# Altium project LPCB235__RLOOP__FCU.PrjPCB (part 7 of 7)
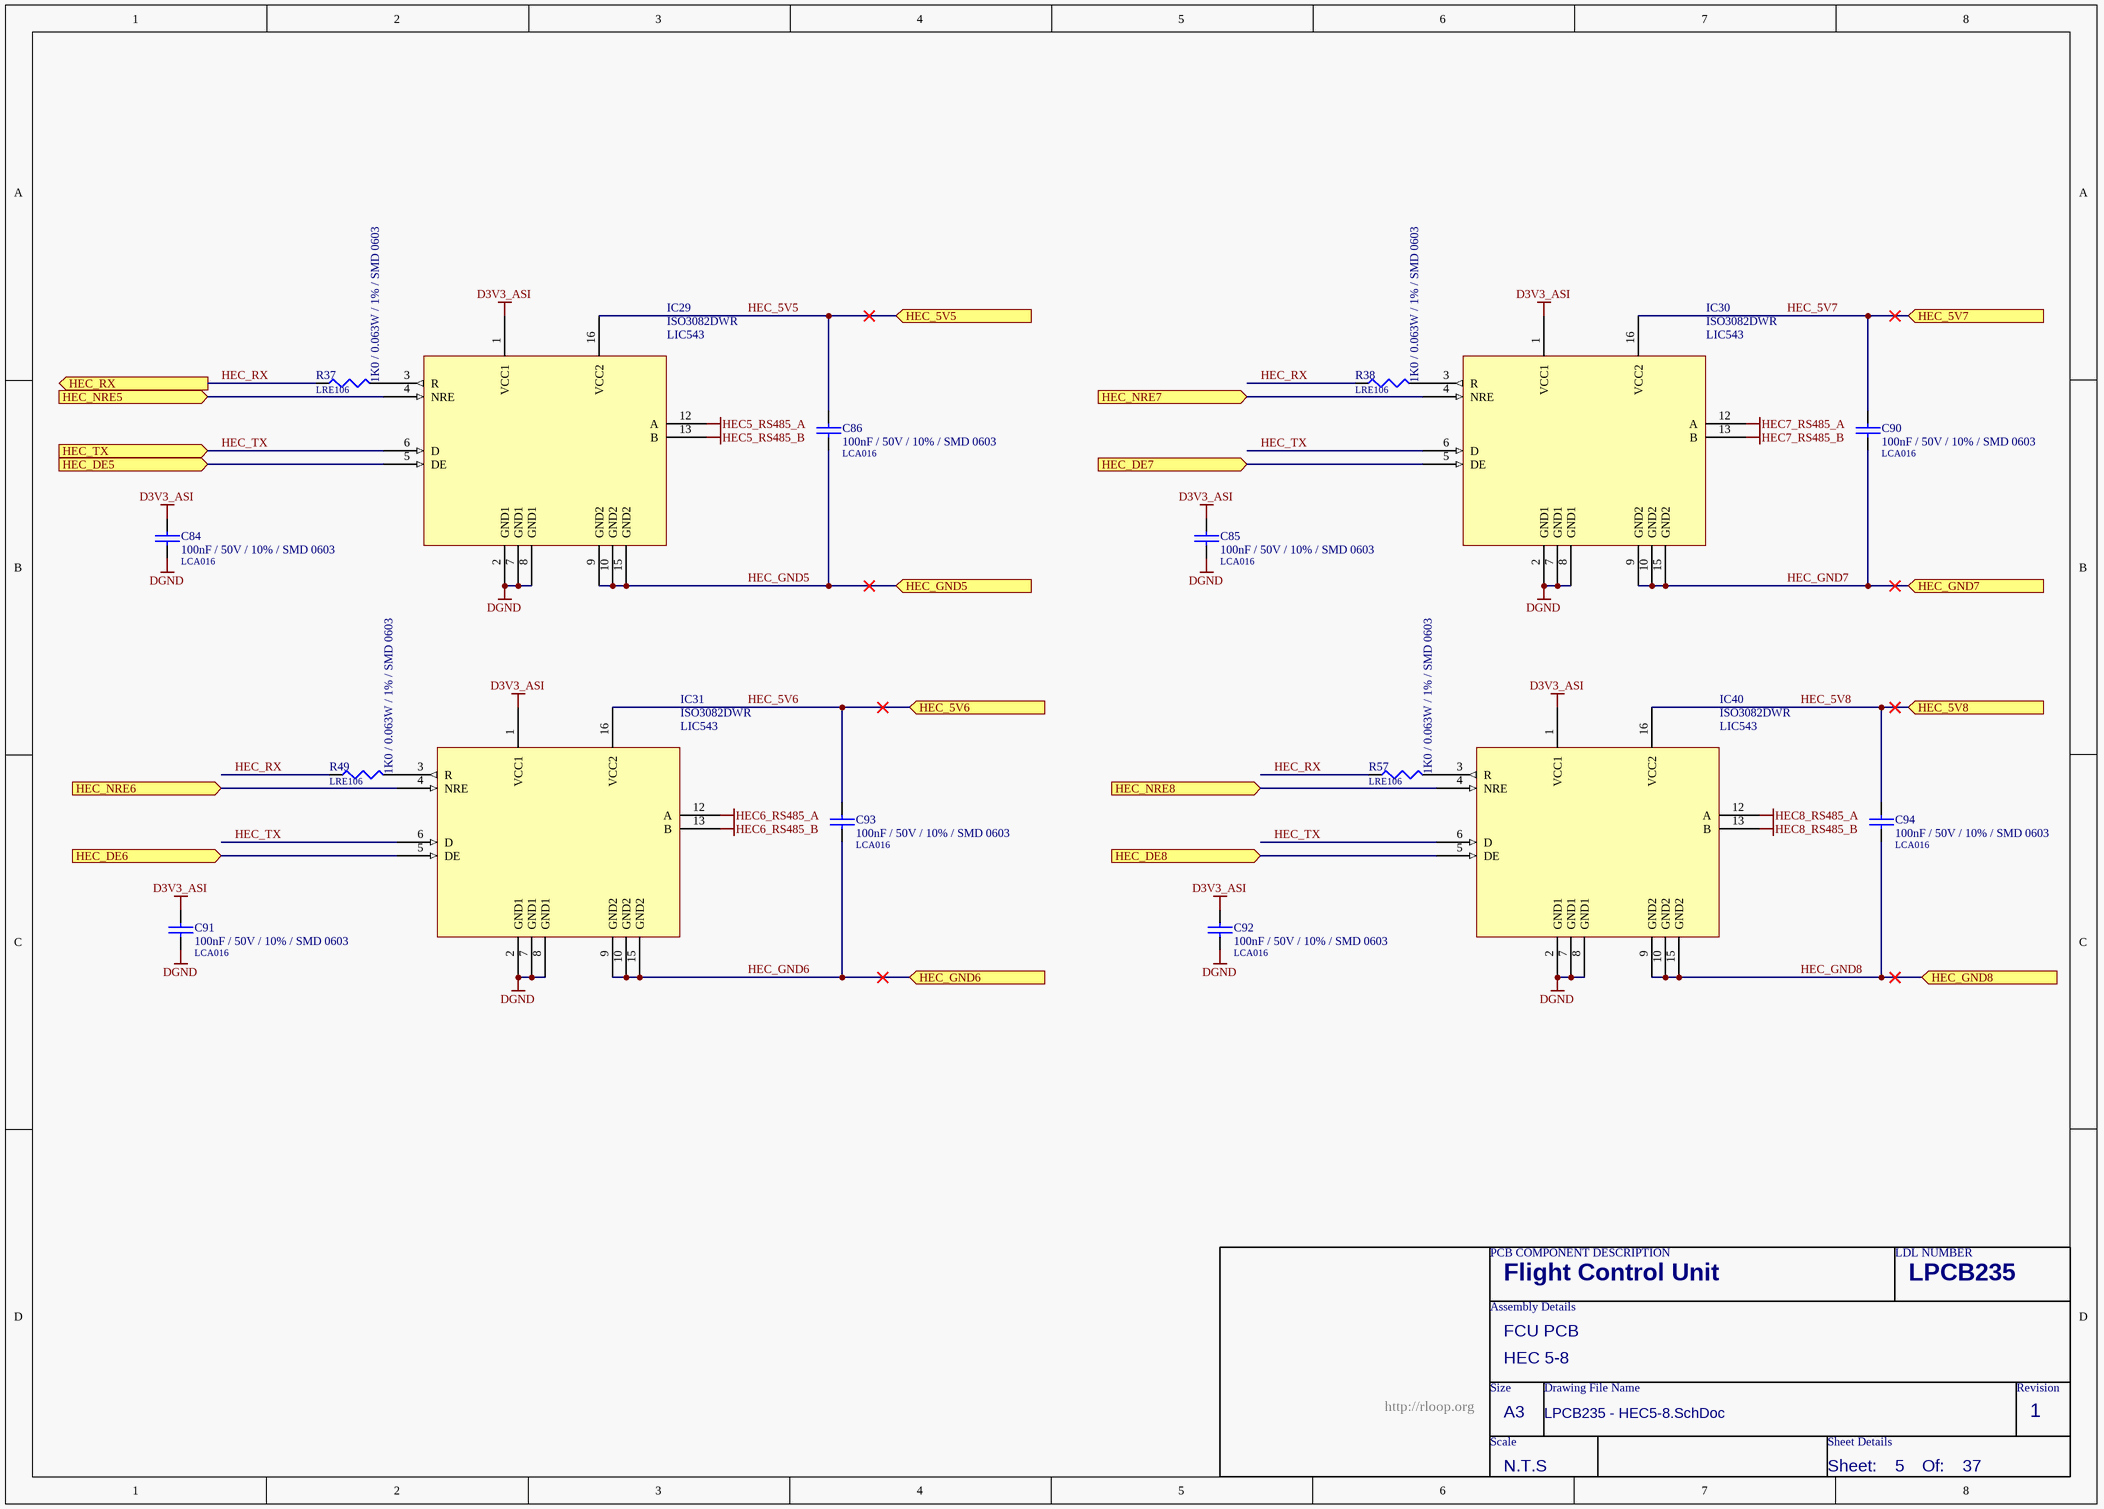
[diagram p37: LPCB235 - HEC5-8.SchDoc]

## Nets that join several sheets
B1_G210_DIR: LPCB235 - IO Connector (CN1.2G_B), LPCB235 - G210 IF AND MUX (IC46.4)
B1_G210_STEP: LPCB235 - IO Connector (CN1.3F_B), LPCB235 - G210 IF AND MUX (IC46.9)
B2_G210_DIR: LPCB235 - IO Connector (CN1.2F_B), LPCB235 - G210 IF AND MUX (IC46.7)
B2_G210_STEP: LPCB235 - IO Connector (CN1.3E_B), LPCB235 - G210 IF AND MUX (IC46.12)
BFAIL_C1: LPCB235 - BRAKE FAILSAFE (RLY2.3), LPCB235 - ANALOG CONNECTOR (CN3.2M_B)
BFAIL_C2: LPCB235 - BRAKE FAILSAFE (RLY2.8), LPCB235 - ANALOG CONNECTOR (CN3.1L_B)
BFAIL_NC1: LPCB235 - BRAKE FAILSAFE (RLY2.2), LPCB235 - ANALOG CONNECTOR (CN3.1M_B)
BFAIL_NC2: LPCB235 - BRAKE FAILSAFE (RLY2.9), LPCB235 - ANALOG CONNECTOR (CN3.4M_B)
BFAIL_NO1: LPCB235 - BRAKE FAILSAFE (RLY2.4), LPCB235 - ANALOG CONNECTOR (CN3.3M_B)
BFAIL_NO2: LPCB235 - BRAKE FAILSAFE (RLY2.7), LPCB235 - ANALOG CONNECTOR (CN3.2L_B)
BRAKE1_SW_EXT: LPCB235 - IO Connector (CN1.1D_B), LPCB235 - BRAKE LIMIT SW (IC43.13)
BRAKE1_SW_RET: LPCB235 - IO Connector (CN1.2D_B), LPCB235 - BRAKE LIMIT SW (IC43.8)
BRAKE2_SW_EXT: LPCB235 - IO Connector (CN1.3D_B), LPCB235 - BRAKE LIMIT SW (IC52.13)
BRAKE2_SW_RET: LPCB235 - IO Connector (CN1.4E_B), LPCB235 - BRAKE LIMIT SW (IC52.8)
CAN_FAST_H: LPCB235 - IO Connector (CN1.1B_B), LPCB235 - CAN Interface (IC4.7 R3.1)
CAN_FAST_L: LPCB235 - IO Connector (CN1.1A_B), LPCB235 - CAN Interface (IC4.6 R3.2)
CONT_LASER_1: LPCB235 - IO Connector (CN1.4A_B), LPCB235 - CONTRAST LASERS (R48.1 R67.1)
CONT_LASER_2: LPCB235 - IO Connector (CN1.4B_B), LPCB235 - CONTRAST LASERS (R70.1 R71.1)
CONT_LASER_3: LPCB235 - IO Connector (CN1.4C_B), LPCB235 - CONTRAST LASERS (R75.1 R76.1)
D1V2_CPU: LPCB235 - POWER MANAGEMENT (5 pins), LPCB235 - RM48 - POWER (23 pins)
D3V3_ASI: LPCB235 - AUX POWER (C139.1 CT2.1 IC45.3), LPCB235 - ASI RS485 (7 pins), LPCB235 - HEC1-4 (8 pins), LPCB235 - HEC5-8 (8 pins)
D3V3_CPU: LPCB235 - POWER MANAGEMENT (7 pins), LPCB235 - RM48 - POWER (43 pins), LPCB235 - RM48 - ANALOG (IC14.V15 IC14.W15), LPCB235 - RM48 - MAIN (6 pins), LPCB235 - RM48 - SERIAL (R84.2 R85.2), LPCB235 - RM48 - 100BASET (12 pins), LPCB235 - MAGNETICS (10 pins), LPCB235 - IMU (9 pins), LPCB235 - DAC (5 pins), LPCB235 - WATCHDOG (C137.1 IC42.5 R89.2), LPCB235 - BRAKE FAILSAFE (C143.1 C144.1 IC50.5 IC51.5)
D3V3_IO: LPCB235 - PUSHER INTERLOCK (C98.1 C102.1 IC23.16 IC24.16), LPCB235 - BRAKE LIMIT SW (C130.1 C145.1 IC43.16 IC52.16), LPCB235 - AUX POWER (C81.1 CT13.1 IC19.3)
D3V3_SER: LPCB235 - SPI UART - GROUP B (12 pins), LPCB235 - SPI UART - GROUP A (17 pins), LPCB235 - SPI UART - GROUP B1 (6 pins)
D5V_IO: LPCB235 - CAN Interface (C5.1 CT1.1 IC4.3), LPCB235 - DAC (8 pins), U_LPCB235 - HE THROTTLES/TH1 (C134_TH1.1 IC38_TH1.1), U_LPCB235 - HE THROTTLES/TH2 (C134_TH2.1 IC38_TH2.1), U_LPCB235 - HE THROTTLES/TH3 (C134_TH3.1 IC38_TH3.1), U_LPCB235 - HE THROTTLES/TH4 (C134_TH4.1 IC38_TH4.1), U_LPCB235 - HE THROTTLES/TH5 (C134_TH5.1 IC38_TH5.1), U_LPCB235 - HE THROTTLES/TH6 (C134_TH6.1 IC38_TH6.1), U_LPCB235 - HE THROTTLES/TH7 (C134_TH7.1 IC38_TH7.1), U_LPCB235 - HE THROTTLES/TH8 (C134_TH8.1 IC38_TH8.1), LPCB235 - CONTRAST LASERS (5 pins), LPCB235 - AUX POWER (C82.1 CT14.1 IC20.3), LPCB235 - G210 IF AND MUX (C140.1 IC46.16), U_LPCB235 - MLP IF/ML1 (C142_ML1.1 IC47_ML1.5), U_LPCB235 - MLP IF/ML2 (C142_ML2.1 IC47_ML2.5)
D5V_SER: U_LPCB235 - SPI UART - GROUP B/OGB1 (C112_OGB1.1 IC32_OGB1.1), U_LPCB235 - SPI UART - GROUP B/OGB2 (C112_OGB2.1 IC32_OGB2.1), U_LPCB235 - SPI UART - GROUP B/OGB3 (C112_OGB3.1 IC32_OGB3.1), LPCB235 - SPI UART - GROUP A (C16.1 C17.1 IC10.3), U_LPCB235 - SPI UART - GROUP A/OGA1 (C14_OGA1.1 IC3_OGA1.1), U_LPCB235 - SPI UART - GROUP A/OGA2 (C14_OGA2.1 IC3_OGA2.1), U_LPCB235 - SPI UART - GROUP A/OGA3 (C14_OGA3.1 IC3_OGA3.1)
DGND: LPCB235 - POWER MANAGEMENT (28 pins), LPCB235 - IO Connector (20 pins), LPCB235 - RM48 - POWER (64 pins), LPCB235 - RM48 - ANALOG (5 pins), LPCB235 - RM48 - MAIN (6 pins), LPCB235 - CAN Interface (C5.2 CT1.2 IC4.2 IC4.8), LPCB235 - RM48 - 100BASET (11 pins), LPCB235 - MAGNETICS (C108.2 C109.2 C110.2 C111.2), LPCB235 - IMU (13 pins), LPCB235 - SPI UART - GROUP B (15 pins), U_LPCB235 - SPI UART - GROUP B/OGB1 (C112_OGB1.2 IC32_OGB1.4), U_LPCB235 - SPI UART - GROUP B/OGB2 (C112_OGB2.2 IC32_OGB2.4), U_LPCB235 - SPI UART - GROUP B/OGB3 (C112_OGB3.2 IC32_OGB3.4), LPCB235 - SPI UART - GROUP A (25 pins), U_LPCB235 - SPI UART - GROUP A/OGA1 (C14_OGA1.2 IC3_OGA1.4), U_LPCB235 - SPI UART - GROUP A/OGA2 (C14_OGA2.2 IC3_OGA2.4), U_LPCB235 - SPI UART - GROUP A/OGA3 (C14_OGA3.2 IC3_OGA3.4), LPCB235 - SPI UART - GROUP B1 (9 pins), LPCB235 - DAC (19 pins), U_LPCB235 - HE THROTTLES/TH1 (C134_TH1.2 IC38_TH1.4 R87_TH1.1), U_LPCB235 - HE THROTTLES/TH2 (C134_TH2.2 IC38_TH2.4 R87_TH2.1), U_LPCB235 - HE THROTTLES/TH3 (C134_TH3.2 IC38_TH3.4 R87_TH3.1), U_LPCB235 - HE THROTTLES/TH4 (C134_TH4.2 IC38_TH4.4 R87_TH4.1), U_LPCB235 - HE THROTTLES/TH5 (C134_TH5.2 IC38_TH5.4 R87_TH5.1), U_LPCB235 - HE THROTTLES/TH6 (C134_TH6.2 IC38_TH6.4 R87_TH6.1), U_LPCB235 - HE THROTTLES/TH7 (C134_TH7.2 IC38_TH7.4 R87_TH7.1), U_LPCB235 - HE THROTTLES/TH8 (C134_TH8.2 IC38_TH8.4 R87_TH8.1), LPCB235 - WATCHDOG (C137.2 IC42.2), LPCB235 - BRAKE FAILSAFE (5 pins), LPCB235 - ANALOG CONNECTOR (CN3.1G_A CN3.2G_A CN3.3G_A CN3.4G_A), LPCB235 - CONTRAST LASERS (8 pins), LPCB235 - PUSHER INTERLOCK (10 pins), LPCB235 - BRAKE LIMIT SW (8 pins), LPCB235 - AUX POWER (24 pins), LPCB235 - G210 IF AND MUX (7 pins), U_LPCB235 - MLP IF/ML1 (6 pins), U_LPCB235 - MLP IF/ML2 (6 pins), LPCB235 - ASI RS485 (10 pins), LPCB235 - HEC1-4 (17 pins), LPCB235 - HEC5-8 (16 pins)
ETHERNET_RX_n: LPCB235 - IO Connector (CN1.3H_B), LPCB235 - MAGNETICS (L3.9)
ETHERNET_RX_p: LPCB235 - IO Connector (CN1.3J_B), LPCB235 - MAGNETICS (L3.11)
ETHERNET_TX_n: LPCB235 - IO Connector (CN1.4H_B), LPCB235 - MAGNETICS (L3.14)
ETHERNET_TX_p: LPCB235 - IO Connector (CN1.4J_B), LPCB235 - MAGNETICS (L3.16)
HEC1_RS485_A: LPCB235 - ANALOG CONNECTOR (CN3.4K_B), LPCB235 - HEC1-4 (IC18.12)
HEC1_RS485_B: LPCB235 - ANALOG CONNECTOR (CN3.3K_B), LPCB235 - HEC1-4 (IC18.13)
HEC2_RS485_A: LPCB235 - ANALOG CONNECTOR (CN3.3J_B), LPCB235 - HEC1-4 (IC26.12)
HEC2_RS485_B: LPCB235 - ANALOG CONNECTOR (CN3.4J_B), LPCB235 - HEC1-4 (IC26.13)
HEC3_RS485_A: LPCB235 - ANALOG CONNECTOR (CN3.3G_B), LPCB235 - HEC1-4 (IC25.12)
HEC3_RS485_B: LPCB235 - ANALOG CONNECTOR (CN3.4G_B), LPCB235 - HEC1-4 (IC25.13)
HEC4_RS485_A: LPCB235 - ANALOG CONNECTOR (CN3.3H_B), LPCB235 - HEC1-4 (IC28.12)
HEC4_RS485_B: LPCB235 - ANALOG CONNECTOR (CN3.4H_B), LPCB235 - HEC1-4 (IC28.13)
HEC5_RS485_A: LPCB235 - ANALOG CONNECTOR (CN3.1F_B), LPCB235 - HEC5-8 (IC29.12)
HEC5_RS485_B: LPCB235 - ANALOG CONNECTOR (CN3.2F_B), LPCB235 - HEC5-8 (IC29.13)
HEC6_RS485_A: LPCB235 - ANALOG CONNECTOR (CN3.1G_B), LPCB235 - HEC5-8 (IC31.12)
HEC6_RS485_B: LPCB235 - ANALOG CONNECTOR (CN3.2G_B), LPCB235 - HEC5-8 (IC31.13)
HEC7_RS485_A: LPCB235 - ANALOG CONNECTOR (CN3.1H_B), LPCB235 - HEC5-8 (IC30.12)
HEC7_RS485_B: LPCB235 - ANALOG CONNECTOR (CN3.2H_B), LPCB235 - HEC5-8 (IC30.13)
HEC8_RS485_A: LPCB235 - ANALOG CONNECTOR (CN3.2J_B), LPCB235 - HEC5-8 (IC40.12)
HEC8_RS485_B: LPCB235 - ANALOG CONNECTOR (CN3.1J_B), LPCB235 - HEC5-8 (IC40.13)
IN_TRUCK_ACC: LPCB235 - POWER MANAGEMENT (C70.1 R28.1 R29.2), LPCB235 - IO Connector (CN1.1C_B)
INTLK_SW1_NC: LPCB235 - IO Connector (CN1.3B_B), LPCB235 - PUSHER INTERLOCK (IC23.7)
INTLK_SW1_NO: LPCB235 - IO Connector (CN1.3A_B), LPCB235 - PUSHER INTERLOCK (IC23.14)
INTLK_SW1_RET: LPCB235 - IO Connector (CN1.2B_B), LPCB235 - PUSHER INTERLOCK (IC23.13)
INTLK_SW2_NC: LPCB235 - IO Connector (CN1.2A_B), LPCB235 - PUSHER INTERLOCK (IC24.7)
INTLK_SW2_NO: LPCB235 - IO Connector (CN1.2C_B), LPCB235 - PUSHER INTERLOCK (IC24.14)
INTLK_SW2_RET: LPCB235 - IO Connector (CN1.3C_B), LPCB235 - PUSHER INTERLOCK (IC24.13)
P12V_HOT: LPCB235 - POWER MANAGEMENT (D4.2), LPCB235 - SPI UART - GROUP A (D1.2 D2.2), LPCB235 - BRAKE FAILSAFE (D10.3 RLY2.1), LPCB235 - ANALOG CONNECTOR (6 pins), LPCB235 - AUX POWER (D6.2 D7.2 D17.2 L4.2)
P24V_HOT: LPCB235 - IO Connector (6 pins), LPCB235 - AUX POWER (7 pins)
P24V_HOT_A: LPCB235 - IO Connector (CN1.1L_B), LPCB235 - AUX POWER (D3.2 R6.2)
P24V_HOT_B: LPCB235 - IO Connector (CN1.2L_B), LPCB235 - AUX POWER (D9.2 R10.2)
ASI_23S17_NCS: LPCB235 - RM48 - SERIAL (IC14.H16), LPCB235 - ASI RS485 (IC17.11 R32.1)
ASI_23S17_NRST: LPCB235 - RM48 - SERIAL (IC14.E19), LPCB235 - ASI RS485 (IC17.18)
ASI_MISO: LPCB235 - RM48 - SERIAL (IC14.G18), LPCB235 - ASI RS485 (IC5.4 IC17.14)
ASI_MOSI: LPCB235 - RM48 - SERIAL (IC14.F19), LPCB235 - ASI RS485 (IC5.3 IC17.13)
ASI_SCLK: LPCB235 - RM48 - SERIAL (IC14.F18), LPCB235 - ASI RS485 (IC5.5 IC17.12)
ASI_SER_NCS: LPCB235 - RM48 - SERIAL (IC14.G16), LPCB235 - ASI RS485 (IC5.2 R9.1)
ASI_SER_NIRQ: LPCB235 - RM48 - GIO (IC14.F1), LPCB235 - ASI RS485 (IC5.7 R31.1)
ASI_SER_NRST: LPCB235 - RM48 - N2HET (IC14.J4), LPCB235 - ASI RS485 (IC5.14)
B1_SW_EXT: LPCB235 - RM48 - GIO (IC14.C2), LPCB235 - BRAKE LIMIT SW (IC43.12)
B1_SW_RET: LPCB235 - RM48 - GIO (IC14.A5), LPCB235 - BRAKE LIMIT SW (IC43.9)
B2_SW_EXT: LPCB235 - RM48 - N2HET (IC14.V7), LPCB235 - BRAKE LIMIT SW (IC52.12)
B2_SW_RET: LPCB235 - RM48 - N2HET (IC14.B3), LPCB235 - BRAKE LIMIT SW (IC52.9)
BRAKE1_DIR: LPCB235 - RM48 - SERIAL (IC14.B6), LPCB235 - G210 IF AND MUX (IC46.3)
BRAKE1_STEP: LPCB235 - RM48 - SERIAL (IC14.N3), LPCB235 - G210 IF AND MUX (IC46.10)
BRAKE2_DIR: LPCB235 - RM48 - N2HET (IC14.H4), LPCB235 - G210 IF AND MUX (IC46.6)
BRAKE2_STEP: LPCB235 - RM48 - SERIAL (IC14.D3), LPCB235 - G210 IF AND MUX (IC46.13)
CAN_FAST_RX: LPCB235 - CAN Interface (R5.1), LPCB235 - RM48 - SERIAL (IC14.B10)
CAN_FAST_TX: LPCB235 - CAN Interface (IC4.1), LPCB235 - RM48 - SERIAL (IC14.A10)
CHA_DAC_NCNVT: LPCB235 - RM48 - N2HET (IC14.B13), LPCB235 - DAC (IC37.3)
CHA_DAC_NDAV: LPCB235 - RM48 - GIO (IC14.B5), LPCB235 - DAC (IC37.2 R78.1)
CHA_DAC_NRST: LPCB235 - RM48 - N2HET (IC14.J1), LPCB235 - DAC (IC37.1)
CHA_NDSC_CLR0: LPCB235 - RM48 - N2HET (IC14.A4), LPCB235 - DAC (IC37.17)
CHA_NDSC_CLR1: LPCB235 - RM48 - N2HET (IC14.A13), LPCB235 - DAC (IC37.63)
CHA_WDT_PULSE: LPCB235 - RM48 - SERIAL (IC14.J3), LPCB235 - WATCHDOG (IC42.4)
CM30_RX: LPCB235 - IO Connector (CN1.1F_B), LPCB235 - SPI UART - GROUP B1 (IC35.13)
CM30_TX: LPCB235 - IO Connector (CN1.1G_B), LPCB235 - SPI UART - GROUP B1 (IC35.14)
HE_THROTTLE1: LPCB235 - DAC (IC37.26), U_LPCB235 - HE THROTTLES/TH1 (R80_TH1.2)
HE_THROTTLE2: LPCB235 - DAC (IC37.25), U_LPCB235 - HE THROTTLES/TH2 (R80_TH2.2)
HE_THROTTLE3: LPCB235 - DAC (IC37.24), U_LPCB235 - HE THROTTLES/TH3 (R80_TH3.2)
HE_THROTTLE4: LPCB235 - DAC (IC37.20), U_LPCB235 - HE THROTTLES/TH4 (R80_TH4.2)
HE_THROTTLE5: LPCB235 - DAC (IC37.19), U_LPCB235 - HE THROTTLES/TH5 (R80_TH5.2)
HE_THROTTLE6: LPCB235 - DAC (IC37.18), U_LPCB235 - HE THROTTLES/TH6 (R80_TH6.2)
HE_THROTTLE7: LPCB235 - DAC (IC37.51), U_LPCB235 - HE THROTTLES/TH7 (R80_TH7.2)
HE_THROTTLE8: LPCB235 - DAC (IC37.52), U_LPCB235 - HE THROTTLES/TH8 (R80_TH8.2)
HEC_5V1: U_LPCB235 - HE THROTTLES/TH1 (C128_TH1.1 C129_TH1.1 IC38_TH1.8 IC39_TH1.5), LPCB235 - ANALOG CONNECTOR (CN3.2A_A), LPCB235 - HEC1-4 (C75.1 IC18.16)
HEC_5V2: U_LPCB235 - HE THROTTLES/TH2 (C128_TH2.1 C129_TH2.1 IC38_TH2.8 IC39_TH2.5), LPCB235 - ANALOG CONNECTOR (CN3.2B_A), LPCB235 - HEC1-4 (C79.1 IC26.16)
HEC_5V3: U_LPCB235 - HE THROTTLES/TH3 (C128_TH3.1 C129_TH3.1 IC38_TH3.8 IC39_TH3.5), LPCB235 - ANALOG CONNECTOR (CN3.4C_A), LPCB235 - HEC1-4 (C76.1 IC25.16)
HEC_5V4: U_LPCB235 - HE THROTTLES/TH4 (C128_TH4.1 C129_TH4.1 IC38_TH4.8 IC39_TH4.5), LPCB235 - ANALOG CONNECTOR (CN3.3B_A), LPCB235 - HEC1-4 (C83.1 IC28.16)
HEC_5V5: U_LPCB235 - HE THROTTLES/TH5 (C128_TH5.1 C129_TH5.1 IC38_TH5.8 IC39_TH5.5), LPCB235 - ANALOG CONNECTOR (CN3.3F_A), LPCB235 - HEC5-8 (C86.1 IC29.16)
HEC_5V6: U_LPCB235 - HE THROTTLES/TH6 (C128_TH6.1 C129_TH6.1 IC38_TH6.8 IC39_TH6.5), LPCB235 - ANALOG CONNECTOR (CN3.4E_A), LPCB235 - HEC5-8 (C93.1 IC31.16)
HEC_5V7: U_LPCB235 - HE THROTTLES/TH7 (C128_TH7.1 C129_TH7.1 IC38_TH7.8 IC39_TH7.5), LPCB235 - ANALOG CONNECTOR (CN3.1E_A), LPCB235 - HEC5-8 (C90.1 IC30.16)
HEC_5V8: U_LPCB235 - HE THROTTLES/TH8 (C128_TH8.1 C129_TH8.1 IC38_TH8.8 IC39_TH8.5), LPCB235 - ANALOG CONNECTOR (CN3.1D_A), LPCB235 - HEC5-8 (C94.1 IC40.16)
HEC_DE1: LPCB235 - ASI RS485 (IC17.21), LPCB235 - HEC1-4 (IC18.5)
HEC_DE2: LPCB235 - ASI RS485 (IC17.22), LPCB235 - HEC1-4 (IC26.5)
HEC_DE3: LPCB235 - ASI RS485 (IC17.23), LPCB235 - HEC1-4 (IC25.5)
HEC_DE4: LPCB235 - ASI RS485 (IC17.24), LPCB235 - HEC1-4 (IC28.5)
HEC_DE5: LPCB235 - ASI RS485 (IC17.25), LPCB235 - HEC5-8 (IC29.5)
HEC_DE6: LPCB235 - ASI RS485 (IC17.26), LPCB235 - HEC5-8 (IC31.5)
HEC_DE7: LPCB235 - ASI RS485 (IC17.27), LPCB235 - HEC5-8 (IC30.5)
HEC_DE8: LPCB235 - ASI RS485 (IC17.28), LPCB235 - HEC5-8 (IC40.5)
HEC_GND1: U_LPCB235 - HE THROTTLES/TH1 (5 pins), LPCB235 - ANALOG CONNECTOR (CN3.1A_A), LPCB235 - HEC1-4 (C75.2 IC18.9 IC18.10 IC18.15)
HEC_GND2: U_LPCB235 - HE THROTTLES/TH2 (5 pins), LPCB235 - ANALOG CONNECTOR (CN3.1B_A), LPCB235 - HEC1-4 (C79.2 IC26.9 IC26.10 IC26.15)
HEC_GND3: U_LPCB235 - HE THROTTLES/TH3 (5 pins), LPCB235 - ANALOG CONNECTOR (CN3.3C_A), LPCB235 - HEC1-4 (C76.2 IC25.9 IC25.10 IC25.15)
HEC_GND4: U_LPCB235 - HE THROTTLES/TH4 (5 pins), LPCB235 - ANALOG CONNECTOR (CN3.4A_A), LPCB235 - HEC1-4 (C83.2 IC28.9 IC28.10 IC28.15)
HEC_GND5: U_LPCB235 - HE THROTTLES/TH5 (5 pins), LPCB235 - ANALOG CONNECTOR (CN3.4F_A), LPCB235 - HEC5-8 (C86.2 IC29.9 IC29.10 IC29.15)
HEC_GND6: U_LPCB235 - HE THROTTLES/TH6 (5 pins), LPCB235 - ANALOG CONNECTOR (CN3.2F_A), LPCB235 - HEC5-8 (C93.2 IC31.9 IC31.10 IC31.15)
HEC_GND7: U_LPCB235 - HE THROTTLES/TH7 (5 pins), LPCB235 - ANALOG CONNECTOR (CN3.3D_A), LPCB235 - HEC5-8 (C90.2 IC30.9 IC30.10 IC30.15)
HEC_GND8: U_LPCB235 - HE THROTTLES/TH8 (5 pins), LPCB235 - ANALOG CONNECTOR (CN3.2D_A), LPCB235 - HEC5-8 (C94.2 IC40.9 IC40.10 IC40.15)
HEC_NRE1: LPCB235 - ASI RS485 (IC17.1), LPCB235 - HEC1-4 (IC18.4)
HEC_NRE2: LPCB235 - ASI RS485 (IC17.2), LPCB235 - HEC1-4 (IC26.4)
HEC_NRE3: LPCB235 - ASI RS485 (IC17.3), LPCB235 - HEC1-4 (IC25.4)
HEC_NRE4: LPCB235 - ASI RS485 (IC17.4), LPCB235 - HEC1-4 (IC28.4)
HEC_NRE5: LPCB235 - ASI RS485 (IC17.5), LPCB235 - HEC5-8 (IC29.4)
HEC_NRE6: LPCB235 - ASI RS485 (IC17.6), LPCB235 - HEC5-8 (IC31.4)
HEC_NRE7: LPCB235 - ASI RS485 (IC17.7), LPCB235 - HEC5-8 (IC30.4)
HEC_NRE8: LPCB235 - ASI RS485 (IC17.8), LPCB235 - HEC5-8 (IC40.4)
HEC_RX: LPCB235 - ASI RS485 (IC5.13), LPCB235 - HEC1-4 (R33.1 R34.1 R35.1 R36.1), LPCB235 - HEC5-8 (R37.1 R38.1 R49.1 R57.1)
HEC_SIG1: U_LPCB235 - HE THROTTLES/TH1 (IC39_TH1.1 R79_TH1.1), LPCB235 - ANALOG CONNECTOR (CN3.3A_A)
HEC_SIG2: U_LPCB235 - HE THROTTLES/TH2 (IC39_TH2.1 R79_TH2.1), LPCB235 - ANALOG CONNECTOR (CN3.2C_A)
HEC_SIG3: U_LPCB235 - HE THROTTLES/TH3 (IC39_TH3.1 R79_TH3.1), LPCB235 - ANALOG CONNECTOR (CN3.4D_A)
HEC_SIG4: U_LPCB235 - HE THROTTLES/TH4 (IC39_TH4.1 R79_TH4.1), LPCB235 - ANALOG CONNECTOR (CN3.4B_A)
HEC_SIG5: U_LPCB235 - HE THROTTLES/TH5 (IC39_TH5.1 R79_TH5.1), LPCB235 - ANALOG CONNECTOR (CN3.1F_A)
HEC_SIG6: U_LPCB235 - HE THROTTLES/TH6 (IC39_TH6.1 R79_TH6.1), LPCB235 - ANALOG CONNECTOR (CN3.3E_A)
HEC_SIG7: U_LPCB235 - HE THROTTLES/TH7 (IC39_TH7.1 R79_TH7.1), LPCB235 - ANALOG CONNECTOR (CN3.2E_A)
HEC_SIG8: U_LPCB235 - HE THROTTLES/TH8 (IC39_TH8.1 R79_TH8.1), LPCB235 - ANALOG CONNECTOR (CN3.1C_A)
HEC_TX: LPCB235 - ASI RS485 (IC5.12), LPCB235 - HEC1-4 (5 pins), LPCB235 - HEC5-8 (IC29.6 IC30.6 IC31.6 IC40.6)
I2C_SCL: LPCB235 - RM48 - SERIAL (IC14.C3 R85.1), LPCB235 - IMU (IC1.4 IC6.4), LPCB235 - DAC (IC37.5)
I2C_SDA: LPCB235 - RM48 - SERIAL (IC14.B2 R84.1), LPCB235 - IMU (IC1.6 IC6.6), LPCB235 - DAC (IC37.4)
IMU_PITCH1_DRDY: LPCB235 - RM48 - GIO (IC14.H3), LPCB235 - IMU (IC1.11)
IMU_PITCH2_DRDY: LPCB235 - RM48 - GIO (IC14.M1), LPCB235 - IMU (IC6.11)
MAC_MDCLK: LPCB235 - RM48 - SERIAL (IC14.V5), LPCB235 - RM48 - 100BASET (IC14.V5 IC27.31)
MAC_MDIO: LPCB235 - RM48 - SERIAL (IC14.G3), LPCB235 - RM48 - 100BASET (IC14.G3 IC27.30 R46.2)
MII_COL: LPCB235 - RM48 - SERIAL (IC14.F3), LPCB235 - RM48 - 100BASET (IC14.F3 IC27.42 R41.1)
MII_RXD0: LPCB235 - RM48 - 100BASET (IC14.P1 R45.4), LPCB235 - RM48 - N2HET (IC14.P1)
MII_RXD1: LPCB235 - RM48 - 100BASET (IC14.A14 R45.3), LPCB235 - RM48 - N2HET (IC14.A14)
MII_RXD2: LPCB235 - RM48 - SERIAL (IC14.G19), LPCB235 - RM48 - 100BASET (IC14.G19 R45.2)
MII_RXD3: LPCB235 - RM48 - SERIAL (IC14.H18), LPCB235 - RM48 - 100BASET (IC14.H18 R45.1)
MLP_420IN1: LPCB235 - ANALOG CONNECTOR (CN3.1K_B), U_LPCB235 - MLP IF/ML1 (IC47_ML1.3 R22_ML1.2)
MLP_420IN2: LPCB235 - ANALOG CONNECTOR (CN3.2K_B), U_LPCB235 - MLP IF/ML2 (IC47_ML2.3 R22_ML2.2)
MLP_A1: LPCB235 - RM48 - ANALOG (IC14.W14), U_LPCB235 - MLP IF/ML1 (C141_ML1.1 IC48_ML1.3 R91_ML1.1 R92_ML1.2)
MLP_A2: LPCB235 - RM48 - ANALOG (IC14.V17), U_LPCB235 - MLP IF/ML2 (C141_ML2.1 IC48_ML2.3 R91_ML2.1 R92_ML2.2)
NetIC14_B4: LPCB235 - RM48 - 100BASET (IC14.B4 IC27.40), LPCB235 - RM48 - N2HET (IC14.B4)
NetIC14_B11: LPCB235 - RM48 - 100BASET (IC14.B11 IC27.39), LPCB235 - RM48 - N2HET (IC14.B11)
NetIC14_D19: LPCB235 - RM48 - 100BASET (IC14.D19 IC27.1), LPCB235 - RM48 - N2HET (IC14.D19)
NetIC14_E18: LPCB235 - RM48 - 100BASET (IC14.E18 IC27.6 R43.1), LPCB235 - RM48 - N2HET (IC14.E18)
NetIC14_H19: LPCB235 - RM48 - SERIAL (IC14.H19), LPCB235 - RM48 - 100BASET (IC14.H19 IC27.2)
NetIC14_J18: LPCB235 - RM48 - SERIAL (IC14.J18), LPCB235 - RM48 - 100BASET (IC14.J18 IC27.3)
NetIC14_J19: LPCB235 - RM48 - SERIAL (IC14.J19), LPCB235 - RM48 - 100BASET (IC14.J19 IC27.4)
NetIC14_K18: LPCB235 - RM48 - 100BASET (IC27.29), LPCB235 - RM48 - N2HET (IC14.K18)
NetIC14_K19: LPCB235 - RM48 - 100BASET (IC14.K19 R44.1), LPCB235 - RM48 - N2HET (IC14.K19)
NetIC14_N19: LPCB235 - RM48 - ANALOG (IC14.N19), LPCB235 - RM48 - 100BASET (IC14.N19 IC27.41 R42.1)
NetIC14_R2: LPCB235 - RM48 - SERIAL (IC14.R2), LPCB235 - RM48 - 100BASET (IC14.R2 IC27.5)
OPTONCDTA_GRN1: LPCB235 - IO Connector (CN1.1A_A), U_LPCB235 - SPI UART - GROUP A/OGA1 (IC3_OGA1.8 R21_OGA1.1)
OPTONCDTA_GRN2: LPCB235 - IO Connector (CN1.1C_A), U_LPCB235 - SPI UART - GROUP A/OGA2 (IC3_OGA2.8 R21_OGA2.1)
OPTONCDTA_GRN3: LPCB235 - IO Connector (CN1.1E_A), U_LPCB235 - SPI UART - GROUP A/OGA3 (IC3_OGA3.8 R21_OGA3.1)
OPTONCDTA_GRY1: LPCB235 - IO Connector (CN1.2B_A), U_LPCB235 - SPI UART - GROUP A/OGA1 (IC3_OGA1.6)
OPTONCDTA_GRY2: LPCB235 - IO Connector (CN1.2D_A), U_LPCB235 - SPI UART - GROUP A/OGA2 (IC3_OGA2.6)
OPTONCDTA_GRY3: LPCB235 - IO Connector (CN1.2F_A), U_LPCB235 - SPI UART - GROUP A/OGA3 (IC3_OGA3.6)
OPTONCDTA_PNK1: LPCB235 - IO Connector (CN1.1B_A), U_LPCB235 - SPI UART - GROUP A/OGA1 (IC3_OGA1.5)
OPTONCDTA_PNK2: LPCB235 - IO Connector (CN1.2C_A), U_LPCB235 - SPI UART - GROUP A/OGA2 (IC3_OGA2.5)
OPTONCDTA_PNK3: LPCB235 - IO Connector (CN1.2E_A), U_LPCB235 - SPI UART - GROUP A/OGA3 (IC3_OGA3.5)
OPTONCDTA_RX1: LPCB235 - SPI UART - GROUP A (IC7.13), U_LPCB235 - SPI UART - GROUP A/OGA1 (R39_OGA1.1)
OPTONCDTA_RX2: LPCB235 - SPI UART - GROUP A (IC8.13), U_LPCB235 - SPI UART - GROUP A/OGA2 (R39_OGA2.1)
OPTONCDTA_RX3: LPCB235 - SPI UART - GROUP A (IC9.13), U_LPCB235 - SPI UART - GROUP A/OGA3 (R39_OGA3.1)
OPTONCDTA_TX1: LPCB235 - SPI UART - GROUP A (IC7.12), U_LPCB235 - SPI UART - GROUP A/OGA1 (IC3_OGA1.3)
OPTONCDTA_TX2: LPCB235 - SPI UART - GROUP A (IC8.12), U_LPCB235 - SPI UART - GROUP A/OGA2 (IC3_OGA2.3)
OPTONCDTA_TX3: LPCB235 - SPI UART - GROUP A (IC9.12), U_LPCB235 - SPI UART - GROUP A/OGA3 (IC3_OGA3.3)
OPTONCDTA_YEL1: LPCB235 - IO Connector (CN1.2A_A), U_LPCB235 - SPI UART - GROUP A/OGA1 (IC3_OGA1.7 R21_OGA1.2)
OPTONCDTA_YEL2: LPCB235 - IO Connector (CN1.1D_A), U_LPCB235 - SPI UART - GROUP A/OGA2 (IC3_OGA2.7 R21_OGA2.2)
OPTONCDTA_YEL3: LPCB235 - IO Connector (CN1.1F_A), U_LPCB235 - SPI UART - GROUP A/OGA3 (IC3_OGA3.7 R21_OGA3.2)
OPTONCDTB_GRN1: LPCB235 - IO Connector (CN1.3A_A), U_LPCB235 - SPI UART - GROUP B/OGB1 (IC32_OGB1.8 R62_OGB1.1)
OPTONCDTB_GRN2: LPCB235 - IO Connector (CN1.3C_A), U_LPCB235 - SPI UART - GROUP B/OGB2 (IC32_OGB2.8 R62_OGB2.1)
OPTONCDTB_GRN3: LPCB235 - IO Connector (CN1.3E_A), U_LPCB235 - SPI UART - GROUP B/OGB3 (IC32_OGB3.8 R62_OGB3.1)
OPTONCDTB_GRY1: LPCB235 - IO Connector (CN1.4B_A), U_LPCB235 - SPI UART - GROUP B/OGB1 (IC32_OGB1.6)
OPTONCDTB_GRY2: LPCB235 - IO Connector (CN1.4D_A), U_LPCB235 - SPI UART - GROUP B/OGB2 (IC32_OGB2.6)
OPTONCDTB_GRY3: LPCB235 - IO Connector (CN1.4F_A), U_LPCB235 - SPI UART - GROUP B/OGB3 (IC32_OGB3.6)
OPTONCDTB_PNK1: LPCB235 - IO Connector (CN1.4A_A), U_LPCB235 - SPI UART - GROUP B/OGB1 (IC32_OGB1.5)
OPTONCDTB_PNK2: LPCB235 - IO Connector (CN1.4C_A), U_LPCB235 - SPI UART - GROUP B/OGB2 (IC32_OGB2.5)
OPTONCDTB_PNK3: LPCB235 - IO Connector (CN1.4E_A), U_LPCB235 - SPI UART - GROUP B/OGB3 (IC32_OGB3.5)
OPTONCDTB_RX1: LPCB235 - SPI UART - GROUP B (IC11.13), U_LPCB235 - SPI UART - GROUP B/OGB1 (R63_OGB1.1)
OPTONCDTB_RX2: LPCB235 - SPI UART - GROUP B (IC21.13), U_LPCB235 - SPI UART - GROUP B/OGB2 (R63_OGB2.1)
OPTONCDTB_RX3: LPCB235 - SPI UART - GROUP B (IC22.13), U_LPCB235 - SPI UART - GROUP B/OGB3 (R63_OGB3.1)
OPTONCDTB_TX1: LPCB235 - SPI UART - GROUP B (IC11.12), U_LPCB235 - SPI UART - GROUP B/OGB1 (IC32_OGB1.3)
OPTONCDTB_TX2: LPCB235 - SPI UART - GROUP B (IC21.12), U_LPCB235 - SPI UART - GROUP B/OGB2 (IC32_OGB2.3)
OPTONCDTB_TX3: LPCB235 - SPI UART - GROUP B (IC22.12), U_LPCB235 - SPI UART - GROUP B/OGB3 (IC32_OGB3.3)
OPTONCDTB_YEL1: LPCB235 - IO Connector (CN1.3B_A), U_LPCB235 - SPI UART - GROUP B/OGB1 (IC32_OGB1.7 R62_OGB1.2)
OPTONCDTB_YEL2: LPCB235 - IO Connector (CN1.3D_A), U_LPCB235 - SPI UART - GROUP B/OGB2 (IC32_OGB2.7 R62_OGB2.2)
OPTONCDTB_YEL3: LPCB235 - IO Connector (CN1.3F_A), U_LPCB235 - SPI UART - GROUP B/OGB3 (IC32_OGB3.7 R62_OGB3.2)
PI_RX_IN: LPCB235 - IO Connector (CN1.2J_B), LPCB235 - RM48 - SERIAL (IC14.A7)
PI_TX_OUT: LPCB235 - IO Connector (CN1.2K_B), LPCB235 - RM48 - SERIAL (IC14.B7)
PMIC_ENABLE: LPCB235 - POWER MANAGEMENT (IC16.9), LPCB235 - RM48 - GIO (IC14.G2)
PUSH_INTLK_A: LPCB235 - RM48 - N2HET (IC14.B12), LPCB235 - BRAKE FAILSAFE (IC51.1 TP48.1), LPCB235 - PUSHER INTERLOCK (IC23.12)
PUSH_INTLK_B: LPCB235 - RM48 - N2HET (IC14.V6), LPCB235 - BRAKE FAILSAFE (IC51.2 TP49.1), LPCB235 - PUSHER INTERLOCK (IC24.12)
REFLECT_0: LPCB235 - RM48 - N2HET (IC14.W3), LPCB235 - CONTRAST LASERS (R69.1 TP24.1)
REFLECT_1: LPCB235 - RM48 - N2HET (IC14.T1), LPCB235 - CONTRAST LASERS (R73.1 TP25.1)
REFLECT_2: LPCB235 - RM48 - N2HET (IC14.N2), LPCB235 - CONTRAST LASERS (R74.1 TP26.1)
RM48_NRESET: LPCB235 - POWER MANAGEMENT (IC16.23 R24.2), LPCB235 - RM48 - MAIN (IC14.W7 R11.1)
RXD_n: LPCB235 - RM48 - 100BASET (IC27.13), LPCB235 - MAGNETICS (L3.8 R54.1)
RXD_p: LPCB235 - RM48 - 100BASET (IC27.14), LPCB235 - MAGNETICS (L3.6 R53.2)
SER_LASER_CLK: LPCB235 - SPI UART - GROUP B (IC11.15 IC21.15 IC22.15), LPCB235 - SPI UART - GROUP A (IC7.15 IC8.15 IC9.15 R4.2), LPCB235 - SPI UART - GROUP B1 (IC33.15), LPCB235 - ASI RS485 (IC5.15)
SERA_MISO: LPCB235 - RM48 - SERIAL (IC14.V8), LPCB235 - SPI UART - GROUP A (IC7.4 IC8.4 IC9.4)
SERA_MOSI: LPCB235 - RM48 - SERIAL (IC14.W8), LPCB235 - SPI UART - GROUP A (IC7.3 IC8.3 IC9.3)
SERA_NCS_0: LPCB235 - RM48 - SERIAL (IC14.V10), LPCB235 - SPI UART - GROUP A (IC7.2 R1.1)
SERA_NCS_1: LPCB235 - RM48 - SERIAL (IC14.W9), LPCB235 - SPI UART - GROUP A (IC8.2 R7.1)
SERA_NCS_2: LPCB235 - RM48 - SERIAL (IC14.T12), LPCB235 - SPI UART - GROUP A (IC9.2 R19.1)
SERA_NIRQ_0: LPCB235 - RM48 - GIO (IC14.C1), LPCB235 - SPI UART - GROUP A (IC7.7 R2.1)
SERA_NIRQ_1: LPCB235 - RM48 - GIO (IC14.E1), LPCB235 - SPI UART - GROUP A (IC8.7 R8.1)
SERA_NIRQ_2: LPCB235 - RM48 - GIO (IC14.A6), LPCB235 - SPI UART - GROUP A (IC9.7 R20.1)
SERA_NRST: LPCB235 - RM48 - N2HET (IC14.V2), LPCB235 - SPI UART - GROUP A (IC7.14 IC8.14 IC9.14)
SERA_SCK: LPCB235 - RM48 - SERIAL (IC14.V9), LPCB235 - SPI UART - GROUP A (IC7.5 IC8.5 IC9.5)
SERB_MISO: LPCB235 - RM48 - SERIAL (IC14.D2 TP38.1), LPCB235 - SPI UART - GROUP B (IC11.4 IC21.4 IC22.4), LPCB235 - SPI UART - GROUP B1 (IC33.4)
SERB_MOSI: LPCB235 - RM48 - SERIAL (IC14.D1 TP37.1), LPCB235 - SPI UART - GROUP B (IC11.3 IC21.3 IC22.3), LPCB235 - SPI UART - GROUP B1 (IC33.3)
SERB_NCS_0: LPCB235 - RM48 - SERIAL (IC14.E16), LPCB235 - SPI UART - GROUP B (IC11.2 R40.1)
SERB_NCS_1: LPCB235 - RM48 - SERIAL (IC14.E17), LPCB235 - SPI UART - GROUP B (IC21.2 R58.1)
SERB_NCS_2: LPCB235 - RM48 - N2HET (IC14.U1), LPCB235 - SPI UART - GROUP B (IC22.2 R60.1)
SERB_NCS_3: LPCB235 - RM48 - SERIAL (IC14.G17), LPCB235 - SPI UART - GROUP B1 (IC33.2 R64.1)
SERB_NIRQ_0: LPCB235 - RM48 - GIO (IC14.K2), LPCB235 - SPI UART - GROUP B (IC11.7 R55.1)
SERB_NIRQ_1: LPCB235 - RM48 - GIO (IC14.W10), LPCB235 - SPI UART - GROUP B (IC21.7 R59.1)
SERB_NIRQ_2: LPCB235 - RM48 - GIO (IC14.J2), LPCB235 - SPI UART - GROUP B (IC22.7 R61.1)
SERB_NIRQ_3: LPCB235 - RM48 - GIO (IC14.M2), LPCB235 - SPI UART - GROUP B1 (IC33.7 R65.1)
SERB_NRST: LPCB235 - RM48 - N2HET (IC14.W5), LPCB235 - SPI UART - GROUP B (IC11.14 IC21.14 IC22.14), LPCB235 - SPI UART - GROUP B1 (IC33.14)
SERB_SCK: LPCB235 - RM48 - SERIAL (IC14.E2 TP36.1), LPCB235 - SPI UART - GROUP B (IC11.5 IC21.5 IC22.5), LPCB235 - SPI UART - GROUP B1 (IC33.5)
TXD_n: LPCB235 - RM48 - 100BASET (IC27.16), LPCB235 - MAGNETICS (L3.3 R52.1)
TXD_p: LPCB235 - RM48 - 100BASET (IC27.17), LPCB235 - MAGNETICS (L3.1 R51.2)
WDT_GOOD: LPCB235 - WATCHDOG (IC42.1 R89.1), LPCB235 - BRAKE FAILSAFE (IC50.1 TP47.1), LPCB235 - G210 IF AND MUX (IC46.1)

## Assembly variants
STANDARD: not fitted C14 C112 C113 C114 C115 C116 C117 C118 C120 C121 C122 CN2 D9 IC26 IC28 IC29 IC30 IC31 IC35 IC36 IC37 IC38 IC39 IC40 NJ3 R10 R39 R48 R49 R55 R57 R58 R59 R60 R61 R62 R63 R64 R65 R66 R67 R68 R69 R70 R71 R72 R73 R74 R75 R76 R77 TP1 TP2 TP3 TP4 TP5 TP6 TP7 TP8 TP9 TP10 TP11 TP12 TP13 TP14 TP15 TP16 TP17 TP18 TP19 TP20 TP21 TP22 TP23 TP24 TP25 TP26 TP27 TP28 TP29 TP30 TP31 TP32 TP33